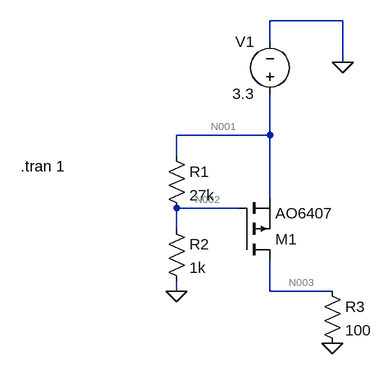
[diagram p0: schematic LeakSensor.asc]
LeakSensor.asc, the LTspice schematic file:
Version 4
SHEET 1 880 680
WIRE 416 -160 304 -160
WIRE 304 -128 304 -160
WIRE 416 -96 416 -160
WIRE 304 16 304 -48
WIRE 304 16 160 16
WIRE 160 48 160 16
WIRE 304 112 304 16
WIRE 256 128 160 128
WIRE 160 160 160 128
WIRE 160 256 160 240
WIRE 304 256 304 208
WIRE 400 256 304 256
FLAG 400 336 0
FLAG 416 -96 0
FLAG 160 256 0
SYMBOL pmos 256 208 M180
SYMATTR InstName M1
SYMATTR Value AO6407
SYMBOL res 144 32 R0
SYMATTR InstName R1
SYMATTR Value 27k
SYMBOL res 144 144 R0
SYMATTR InstName R2
SYMATTR Value 1k
SYMBOL voltage 304 -32 R180
WINDOW 0 24 96 Left 2
WINDOW 3 24 16 Left 2
WINDOW 123 0 0 Left 0
WINDOW 39 0 0 Left 0
SYMATTR InstName V1
SYMATTR Value 3.3
SYMBOL res 384 240 R0
SYMATTR InstName R3
SYMATTR Value 100
TEXT -80 64 Left 2 !.tran 1

The netlist it stands for:
* LeakSensor.asc
M1 N003 N002 N001 N001 AO6407
R1 N001 N002 27k
R2 N002 0 1k
V1 N001 0 3.3
R3 N003 0 100
.model NMOS NMOS
.model PMOS PMOS
.lib standard.mos
.tran 1
.backanno
.end

* Results of the author's LTspice run, read from the files saved beside the schematic
* Operating Point, zero values left out:
*   V(n003) = 3.299 V
*   V(n002) = 117.9 mV
*   V(n001) = 3.3 V
*   Id(M1) = -32.99 mA
*   Is(M1) = 32.99 mA
*   I(R1) = 117.9 µA
*   I(R2) = 117.9 µA
*   I(R3) = 32.99 mA
*   I(V1) = -33.11 mA